# Altium schematic sheet MCU.SchDoc: Soldering Station
size A4; Author: Paulo Peixoto; Revision: 1; SheetNumber: 2; SheetTotal: 5
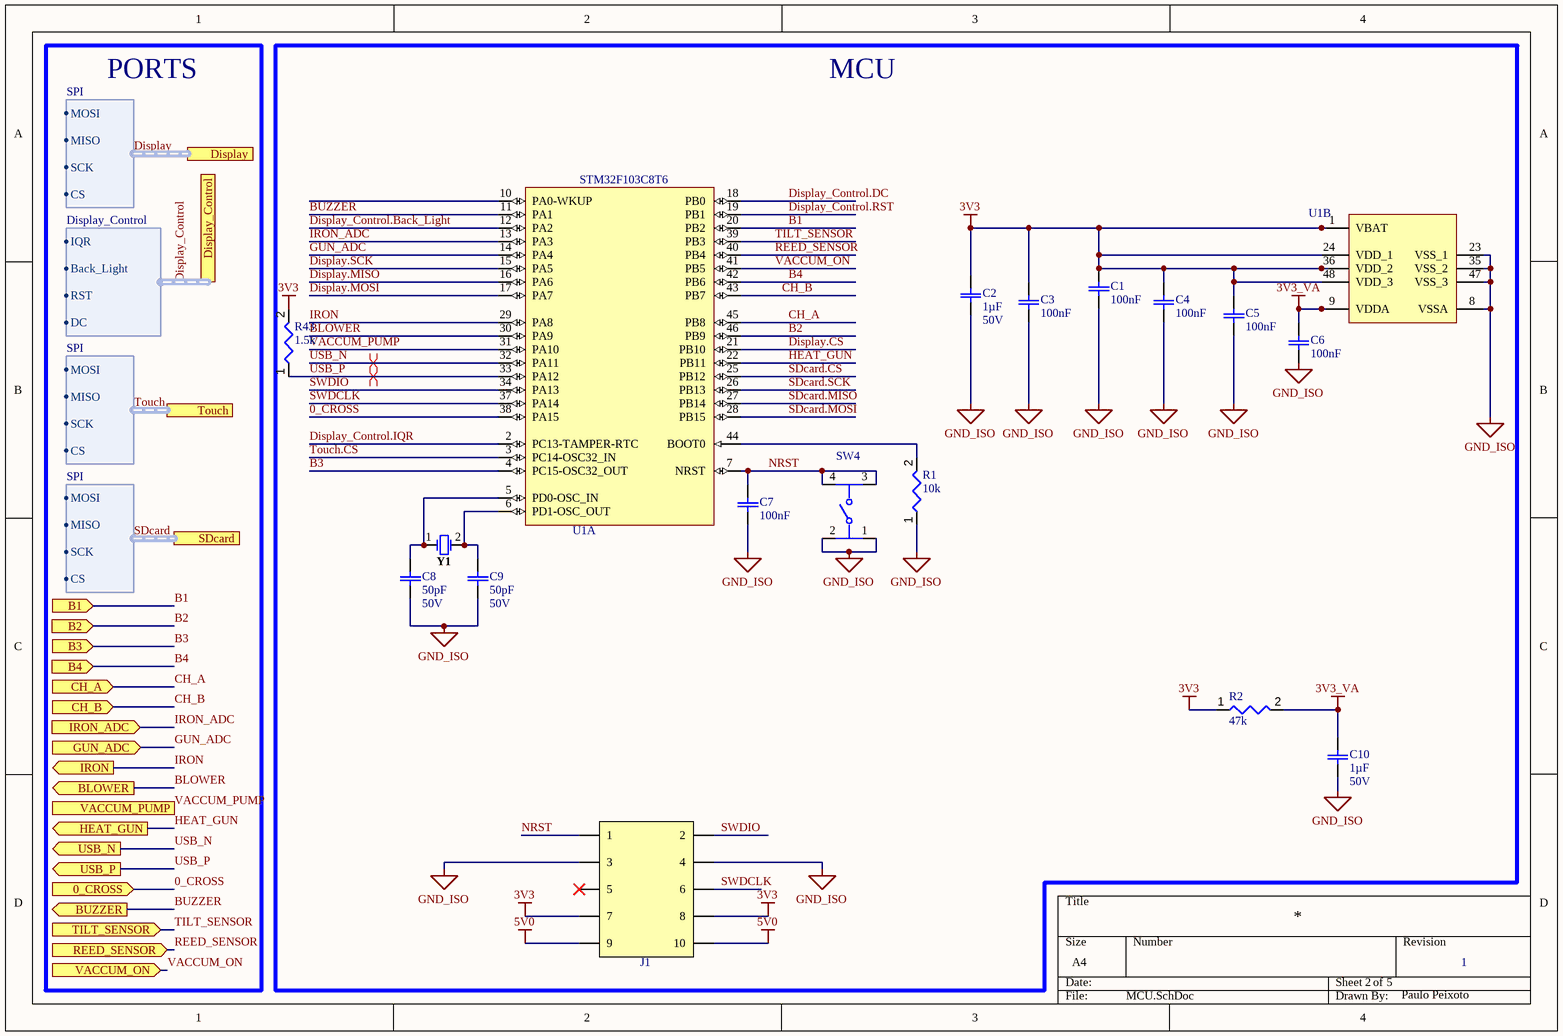
[diagram p0: MCU.SchDoc]

## Parts
C1  value 100nF  [Generic Ceramic 0402 CAP]  (hidden comment: CAP-MLCC_SMD-0402_MR-GCM_n_100nF_50V_10%_X7R)
C2  value 1µF  Voltage Rating: 50V  [Generic Ceramic 0603 CAP]  (hidden comment: CAP-MLCC_SMD-0603_MR-GRT_u_1uF_50V_10%_X5R)
C3  value 100nF  [Generic Ceramic 0402 CAP]  (hidden comment: CAP-MLCC_SMD-0402_MR-GCM_n_100nF_50V_10%_X7R)
C4  value 100nF  [Generic Ceramic 0402 CAP]  (hidden comment: CAP-MLCC_SMD-0402_MR-GCM_n_100nF_50V_10%_X7R)
C5  value 100nF  [Generic Ceramic 0402 CAP]  (hidden comment: CAP-MLCC_SMD-0402_MR-GCM_n_100nF_50V_10%_X7R)
C6  value 100nF  [Generic Ceramic 0402 CAP]  (hidden comment: CAP-MLCC_SMD-0402_MR-GCM_n_100nF_50V_10%_X7R)
C7  value 100nF  [Generic Ceramic 0402 CAP]  (hidden comment: CAP-MLCC_SMD-0402_MR-GCM_n_100nF_50V_10%_X7R)
C8  value 50pF  Voltage Rating: 50V  [Generic Ceramic 0603 CAP]  (hidden comment: CAP-MLCC_SMD-0603_YGE-CC_p_50pF_50V_5%_C0G)
C9  value 50pF  Voltage Rating: 50V  [Generic Ceramic 0603 CAP]  (hidden comment: CAP-MLCC_SMD-0603_YGE-CC_p_50pF_50V_5%_C0G)
C10  value 1µF  Voltage Rating: 50V  [Generic Ceramic 0603 CAP]  (hidden comment: CAP-MLCC_SMD-0603_MR-GRT_u_1uF_50V_10%_X5R)
J1  302-S101  [FP-302-S101-MFG]  (value not drawn)
R1  value 10k  [Generic_0603_RES]  (hidden comment: RES-TK_SMD-0603_VIS-CRCW_K_10K_1/10W_1%)
R2  value 47k  [Generic_0603_RES]  (hidden comment: RES-TK_SMD-0603_VIS-CRCW_K_47K_1/10W_1%)
R43  value 1.5k  [Generic_0402__RES]  (hidden comment: RES-TK_SMD-0402_VIS-CRCW_K_1.5K_1/10W_1%)
SW4  TL1105AF160Q  [FP-TL1105AF160Q-MFG]  (value not drawn)
U1  STM32F103C8T6  [STM-LQFP48_L]  (parts A,B of 2)
Y1  FOXSLF/080-20  [FOX-FOXSLF080-20]  (value not drawn)

## Blocks framed on the sheet
MCU: C1-C10 J1 R1 R2 R43 SW4 U1 Y1

## Ports
0_CROSS (in, see 1[6B], 4[1B]), B1 (in, see 1[4B], 3[1B]), B2 (in, see 1[4B], 3[1B]), B3 (in, see 1[4B], 3[1B]), B4 (in, see 1[4B], 3[1B]), BLOWER (out, see 1[6B], 4[1A]), BUZZER (out, see 1[4B], 3[1C]), CH_A (in, see 1[4B], 3[1B]), CH_B (in, see 1[4B], 3[1C]), Display (harness SPI, see 1[5B], 3[1A]), Display_Control (harness Display_Control, see 1[5B], 3[2A]), GUN_ADC (in, see 1[4C], 5[4C]), HEAT_GUN (out, see 1[6B], 4[1A]), IRON (out, see 1[6B], 4[1A]), IRON_ADC (in, see 1[4C], 5[4A]), REED_SENSOR (in, see 1[5C]), SDcard (harness SPI, see 1[5B], 3[1B]), TILT_SENSOR (in, see 1[5C]), Touch (harness SPI, see 1[5B], 3[1B]), USB_N (out, see 1[4B], 3[1C]), USB_P (out, see 1[4B], 3[1C]), VACCUM_ON (in, see 1[5C]), VACCUM_PUMP (out, see 1[6B], 4[1A])

## Harnesses
SPI: MOSI, MISO, SCK, CS
Display_Control: IQR, Back_Light, RST, DC

## Nets
3V3: C1.2 C2.2 C3.2 C4.2 C5.2 J1.7 J1.8 R2.1 R43.2 U1.1(VBAT) U1.24(VDD_1) U1.36(VDD_2) U1.48(VDD_3)
3V3_VA: C6.2 C10.2 R2.2 U1.9(VDDA)
5V0: J1.9 J1.10
GND_ISO: C1.1 C2.1 C3.1 C4.1 C5.1 C6.1 C7.1 C8.2 C9.2 C10.1 J1.3 J1.4 R1.1 SW4.1 SW4.2 U1.8(VSSA) U1.23(VSS_1) U1.35(VSS_2) U1.47(VSS_3)
0_CROSS: U1.38(PA15) ; port 0_CROSS
B1: U1.20(PB2) ; port B1
B2: U1.46(PB9) ; port B2
B3: U1.4(PC15-OSC32_OUT) ; port B3
B4: U1.42(PB6) ; port B4
BLOWER: U1.30(PA9) ; port BLOWER
BUZZER: U1.11(PA1) ; port BUZZER
CH_A: U1.45(PB8) ; port CH_A
CH_B: U1.43(PB7) ; port CH_B
Display.CS: U1.21(PB10)
Display.MISO: U1.16(PA6)
Display.MOSI: U1.17(PA7)
Display.SCK: U1.15(PA5)
Display_Control.Back_Light: U1.12(PA2)
Display_Control.DC: U1.18(PB0)
Display_Control.IQR: U1.2(PC13-TAMPER-RTC)
Display_Control.RST: U1.19(PB1)
GUN_ADC: U1.14(PA4) ; port GUN_ADC
HEAT_GUN: U1.22(PB11) ; port HEAT_GUN
IRON: U1.29(PA8) ; port IRON
IRON_ADC: U1.13(PA3) ; port IRON_ADC
NRST: C7.2 J1.1 SW4.3 SW4.4 U1.7(NRST)
REED_SENSOR: U1.40(PB4) ; port REED_SENSOR
SDcard.CS: U1.25(PB12)
SDcard.MISO: U1.27(PB14)
SDcard.MOSI: U1.28(PB15)
SDcard.SCK: U1.26(PB13)
SWDCLK: J1.6 U1.37(PA14)
SWDIO: J1.2 U1.34(PA13)
TILT_SENSOR: U1.39(PB3) ; port TILT_SENSOR
Touch.CS: U1.3(PC14-OSC32_IN)
USB_N: U1.32(PA11) ; port USB_N
USB_P: R43.1 U1.33(PA12) ; port USB_P
VACCUM_ON: U1.41(PB5) ; port VACCUM_ON
VACCUM_PUMP: U1.31(PA10) ; port VACCUM_PUMP
NetC8_1: C8.1 U1.5(PD0-OSC_IN) Y1.1
NetC9_1: C9.1 U1.6(PD1-OSC_OUT) Y1.2
NetR1_2: R1.2 U1.44(BOOT0)

Not connected (* = marked no-connect by the designer): J1 5*; U1 10(PA0-WKUP)

## Buses and harness runs
harness Display = port Display
harness Display_Control = port Display_Control
harness SDcard = port SDcard
harness Touch = port Touch

## Layout directives
differential pair: USB_N, USB_P

## Notes on the sheet
- PORTS

## Library data of the parts
C1 C3-C7 = CMP-001-00170-1: Ceramic Capacitor, Ceramic, 50V, 10% +Tol, 10% -Tol, X7R, 15% TC, 0.1uF, Surface Mount, 0402; Mounting Technology: Surface Mount; RoHS Compliant: Yes; Capacitor Type: Ceramic; Min Operating Temperature: -55°C; Case/Package: 0402; Max Operating Temperature: 125°C; Pins: 2
C2 C10 = CMP-001-00191-2: Multilayer Ceramic Capacitors MLCC - SMD/SMT 0603 50Vdc 1.0uF X5R 10%; Case/Package: 0603; Tolerance: 10%; Min Operating Temperature: -55°C; Capacitor Type: Ceramic; Pins: 2; RoHS Compliant: Yes; Mounting Technology: Surface Mount; Automotive: AEQ-200; Max Operating Temperature: 85°C; Dielectric: X5R
C8 C9 = CMP-001-00198-1: Surface Mount Ceramic Multilayer Capacitor 50pF 5% C0G 50V 0603 Paper T/R; Dielectric: COG; Case/Package: 0603; Min Operating Temperature: -55°C; RoHS Compliant: Yes; Automotive: NONE; Capacitor Type: Ceramic; Mounting Technology: Surface Mount; Max Operating Temperature: 125°C; Pins: 2
J1 = CMP-001-0100-1: Conn Shrouded Header (4 Sides) HDR 10 POS 2.54mm Solder ST Thru-Hole; Current Rating: 3A; Connector Type: Male Pin; Number of Contacts: 10; Contact Resistance: 20mΩ; Insulation Resistance: 1GΩ; Terminal Pitch: 2.54mm; RoHS: Compliant; REACH SVHC: Yes; Contact Gender: Male; Row Spacing: 2.54mm; Contact Material: Brass; Number of Rows: 2; Max Operating Temperature: 105°C; Color: Black; Pitch: 2.54mm; Contact Plating: Gold; Number of Positions: 10; Termination: Solder; Mounting Technology: Through Hole; Lifecycle Status: Production; Min Operating Temperature: -40°C; Pins: 10; Height: 9.15mm
R1 = CMP-009-00246-1: Fixed Resistor, Metal Glaze/thick Film, 0.1W, 10000ohm, 75V, 1% +/-Tol, 100ppm/Cel, Surface Mount, 0603; Power: 100mW; Mounting Technology: Surface Mount; Pins: 2; Min Operating Temperature: -55°C; Tolerance: 1%; RoHS Compliant: Yes; Max Operating Temperature: 155°C; Case/Package: 0603; Voltage Rating: 75V
R2 = CMP-009-00207-2: Fixed Resistor, Metal Glaze/thick Film, 0.1W, 47000ohm, 75V, 1% +/-Tol, 100ppm/Cel, Surface Mount, 0603; Power: 100mW; Case/Package: 0603; Max Operating Temperature: 155°C; Voltage Rating: 75V; RoHS Compliant: Yes; Min Operating Temperature: -55°C; Tolerance: 1%; Mounting Technology: Surface Mount; Pins: 2
R43 = CMP-009-00006-1: Surface Mount Thick Film Resistor, AEC-Q200 CRCW Series, 1.5 kohm, 125 mW, - 1%, 50 V; Power Rating: 125mW; Voltage Rating: 50V; Pins: 2; Case Code (Imperial): 0402; Max Operating Temperature: 155°C; Composition: Thick Film; REACH SVHC: Unknown; RoHS: Compliant; Min Operating Temperature: -55°C; Tolerance: 1%; Voltage Rating (DC): 50V; Case Code (Metric): 1005; Packaging: Cut Tape; Width: 1mm; Lead Free: Lead Free; Case/Package: 0402
SW4 = CMP-17879-000016-1: SWITCH TACTILE SPST-NO 0.05A 12V; Mechanical Life: 100000Cycles; Contact Current Rating: 50mA; Contact Resistance: 100mR; Switch Function: Off-Mom; Actuator Type: Standard; Actuator Length: 1.4mm; Max Voltage Rating (DC): 50V; Throw Configuration: SPST; Actuator Material: Nylon; Illumination Type: Non-Illuminated; Switch Travel: 0.25mm; Operating Force: 160gf; Package Quantity: 750; Width: 6mm; Series: TL1105; Voltage Rating (DC): 12V; Length: 6mm; Contact Plating: Silver; Color: Black; Housing Material: Nylon; Min Operating Temperature: -20°C; Lead Free: Lead Free; Mount: Through Hole; Termination: PC Pin; RoHS Compliant: Yes; Orientation: Straight; Max Operating Temperature: 70°C; Reach SVHC Compliant: Yes; Packaging: Bulk; Electrical Life: 100000Cycles; Current Rating: 50mA; Contact Material: Bronze; Size: 6mm
U1 = CMP-0237-00215-3: ARM Cortex-M3 32-bit MCU, 64 KB Flash, 20 KB Internal RAM, 37 I/Os, 48-pin LQFP, -40 to 85 degC, Tray; Supply Voltage(Vcc) min (V): 2; Internal RAM Size (kB): 20; FLASH Size (Prog) (kB): 64; A/D Converter: 2x12-bit (10 Channel); I/Os (High Current): 37; Operating Frequency(F) (Processor speed) (MHz): 72; Core: ARM Cortex-M3; ComponentLink3Description: Package Specification; Mounting Technology: Surface Mount; PartNumber: STM32F103C8T6; PackageReference: LQFP48; Packing: Tray; ComponentLink3URL: http://www.st.com/st-web-ui/static/active/en/resource/technical/document/datasheet/DM00058181.pdf; DatasheetVersion: Rev. 16; ComponentLink1URL: http://www.st.com/web/en/home.html; PackageVersion: Rev. 6, 06/2013; ComponentLink2URL: http://www.st.com/st-web-ui/static/active/en/resource/technical/document/datasheet/CD00161566.pdf; ComponentLink1Description: Manufacturer URL; ComponentLink2Description: Datasheet; PackageDescription: 48-Pin Low Profile Quad Flat Package, 7 x 7 mm Body, 0.5 mm Pitch
Y1 = CMP-1749-00002-1: Resistance Weld Thru-Hole Crystal, 8 MHz, -20 to 70 degC, 2-Pin THD, RoHS, Bulk; Dropout Voltage: 2 V; Outputs: 1; Nominal Output Voltage: 5 V; Min Input Voltage: 7 V; Case\Package: TO-263-3; Max Input Voltage: 35 V; Max Ouput Current: 1 A; Length: 10.24 mm; Max Operating Temperature: 125 degC; Mount: Surface Mount; PackageDescription: 2-Pin Through Hole Device, Body 11.35 x 4.65 mm; Package Quantity: 50; Pins: 3; ComponentLink2URL: http://download.siliconexpert.com/pdfs/2015/4/5/6/5/7/200/fox_/manual/35607121449963728hc49slf.pdf; PackageReference: FOXSLF080-20; Min Operating Temperature: 0 degC; Height: 30.02 mm; Packaging: Rail/Tube; Radiation Hardening: No; Width: 9.35 mm; ComponentLink1URL: http://www.foxonline.com/; DatasheetVersion: Mar-15; ComponentLink1Description: Manufacturer URL; Output Voltage: 5 V; RoHSCompliant: true; REACH SVHC: No SVHC; Output Current: 1 A; ComponentLink2Description: Datasheet